# EAGLE design M1103A (EAGLE 6.6.0)
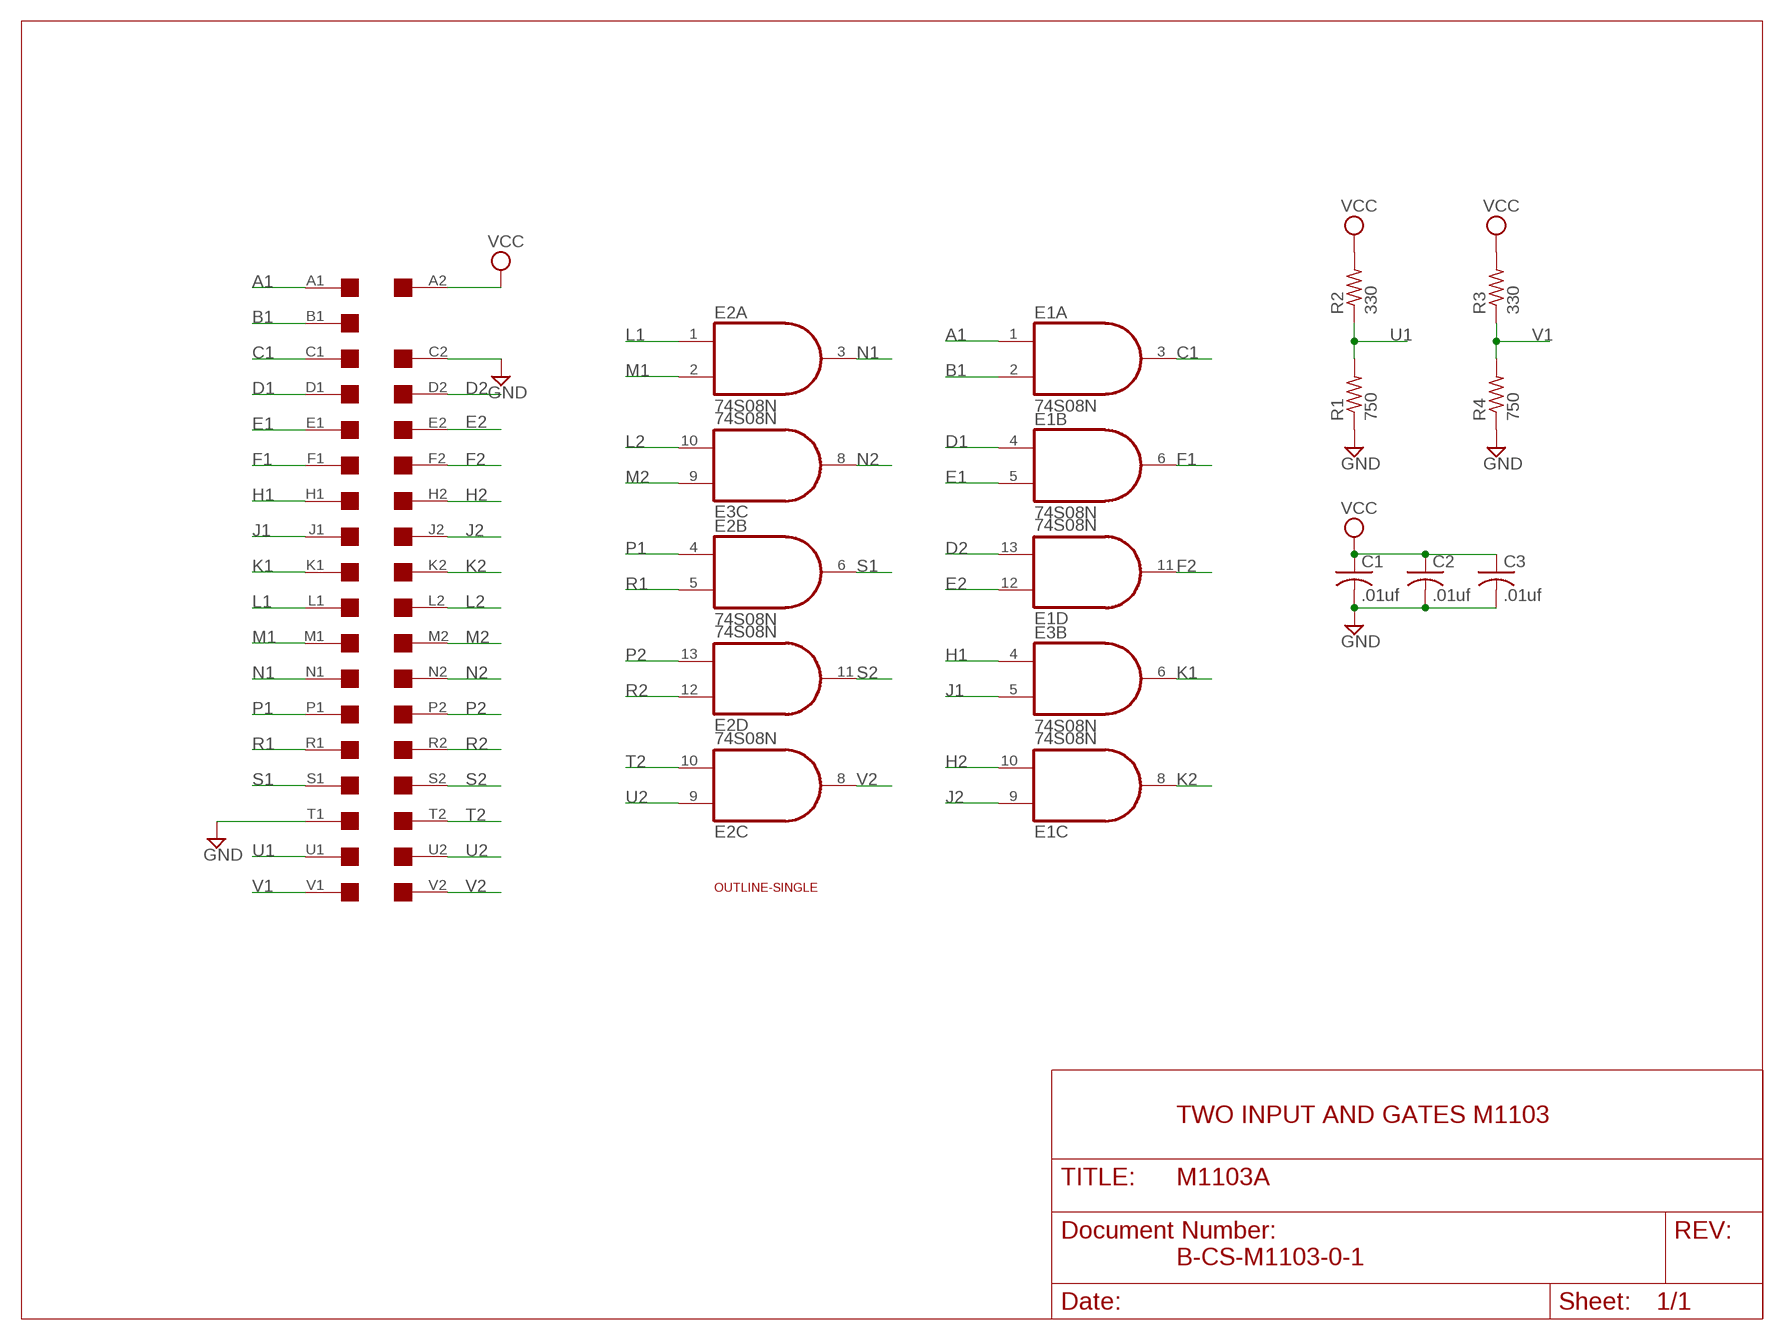
[diagram p0: schematic, sheet 1]

## Parts
C1  .01uf  C-US050-025X075  [C050-025X075]
C2  .01uf  C-US050-025X075  [C050-025X075]
C3  .01uf  C-US050-025X075  [C050-025X075]
E1  74S08N  [DIL14]
E2  74S08N  [DIL14]
E3  74S08N  [DIL14]
R1  750  R-US_0207/10  [0207/10]
R2  330  R-US_0207/10  [0207/10]
R3  330  R-US_0207/10  [0207/10]
R4  750  R-US_0207/10  [0207/10]
U$1  SINGLE  [EDGE-CON2]
U$2  OUTLINE-SINGLE  [SINGLE]

## Nets
A1: E1.1(A:I0) U$1.A1
B1: E1.2(A:I1) U$1.B1
C1: E1.3(A:O) U$1.C1
D1: E1.4(B:I0) U$1.D1
D2: E1.13(D:I1) U$1.D2
E1: E1.5(B:I1) U$1.E1
E2: E1.12(D:I0) U$1.E2
F1: E1.6(B:O) U$1.F1
F2: E1.11(D:O) U$1.F2
GND [Supply]: C1.2 C2.2 C3.2 R1.1 R4.1 U$1.C2 U$1.T1
H1: E3.4(B:I0) U$1.H1
H2: E1.10(C:I1) U$1.H2
J1: E3.5(B:I1) U$1.J1
J2: E1.9(C:I0) U$1.J2
K1: E3.6(B:O) U$1.K1
K2: E1.8(C:O) U$1.K2
L1: E2.1(A:I0) U$1.L1
L2: E3.10(C:I1) U$1.L2
M1: E2.2(A:I1) U$1.M1
M2: E3.9(C:I0) U$1.M2
N1: E2.3(A:O) U$1.N1
N2: E3.8(C:O) U$1.N2
P1: E2.4(B:I0) U$1.P1
P2: E2.13(D:I1) U$1.P2
R1: E2.5(B:I1) U$1.R1
R2: E2.12(D:I0) U$1.R2
S1: E2.6(B:O) U$1.S1
S2: E2.11(D:O) U$1.S2
T2: E2.10(C:I1) U$1.T2
U1: R1.2 R2.1 U$1.U1
U2: E2.9(C:I0) U$1.U2
V1: R3.1 R4.2 U$1.V1
V2: E2.8(C:O) U$1.V2
VCC [Supply]: C1.1 C2.1 C3.1 R2.2 R3.2 U$1.A2
Unconnected: E3.1(A:I0) E3.2(A:I1) E3.3(A:O) E3.11(D:O) E3.12(D:I0) E3.13(D:I1) U$1.B2

## Notes on the sheet
- TWO INPUT AND GATES M1103
- B-CS-M1103-0-1

## Power pins joined to a net without a drawn wire
GND: E1.7(P:GND) E2.7(P:GND) E3.7(P:GND)
VCC: E1.14(P:VCC) E2.14(P:VCC) E3.14(P:VCC)

## Library data of the parts
C1-C3 = rcl:C-US: CAPACITOR, American symbol
E1-E3 = 74xx-us:74*08: Quad 2-input AND gate
R1-R4 = rcl:R-US_: RESISTOR, American symbol
U$1 = dec-con:SINGLE: Single-Height DEC board
U$2 = dec-con:OUTLINE-*: Board outlines for DEC boards.

## Net classes
1 Supply: width 0.813 mm

## Board
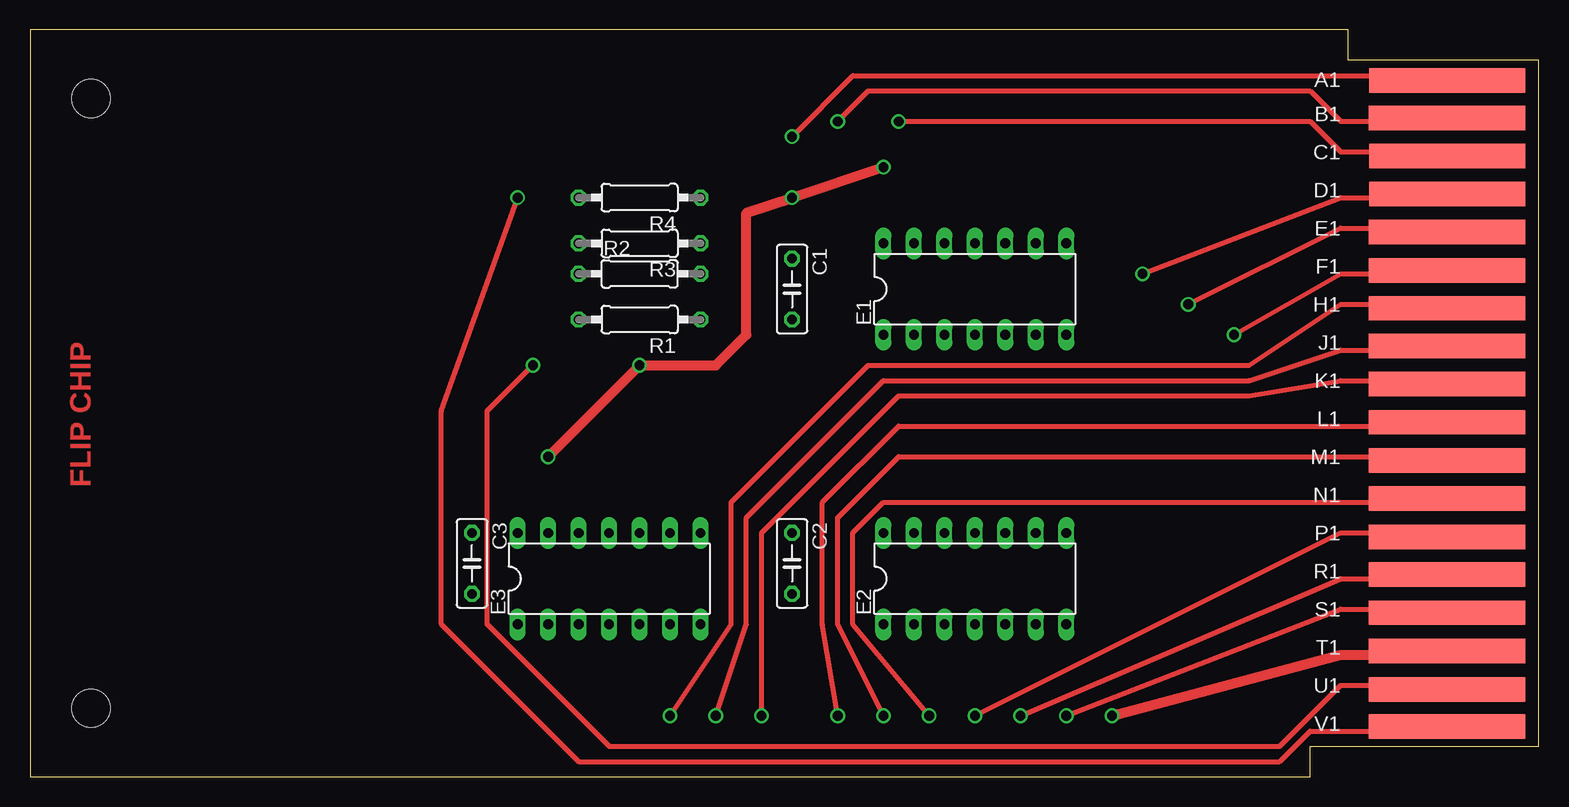
[diagram p1: board, top side]
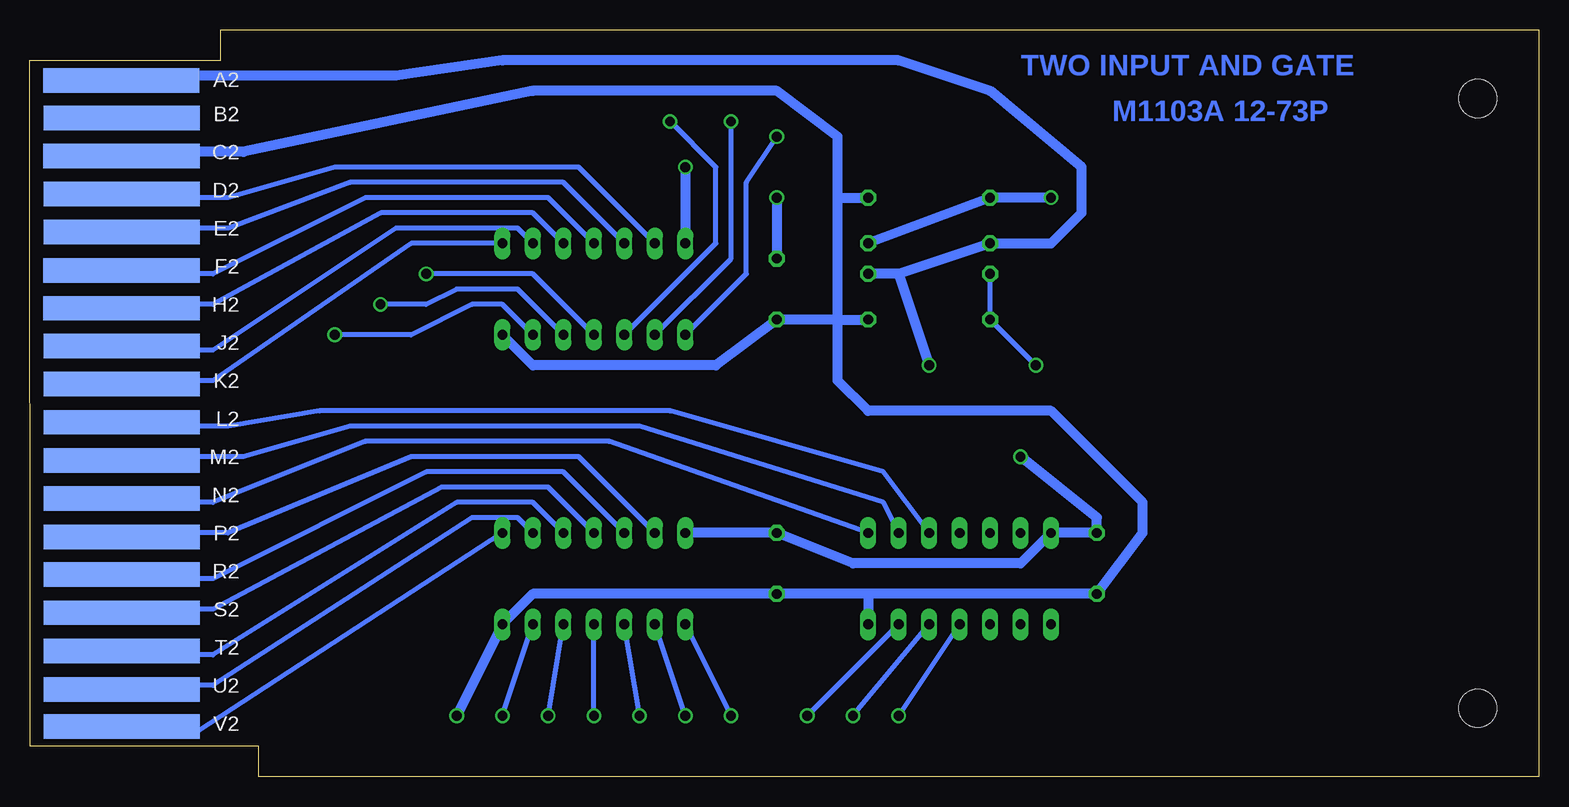
[diagram p2: board, bottom side, seen from below]

Size 125.73 x 62.23 mm. Coordinates in mm from the lower left corner, seen from the top.
Copper layers (1+16): Top 0.035mm / dielectric 1.5mm / Bottom 0.035mm
Design rules "16mils": minimum track width 16mil, minimum drill 32mil, track to track 15mil, track to pad 10mil, pad to pad 10mil, via to via 10mil, smd to smd 10mil, copper to edge 25mil, drill to drill 10mil, minimum pad ring 10mil, minimum via ring 8mil, stop-mask expansion 0mil, vias tented up to drill 0mil, thermal gap 10mil

### Footprints (pad centres in the part's own frame; a part is rotated, then mirrored left to right if it is on the bottom)
C050-025X075 = drill 0.813 octagon: 1 -2.54,0; 2 2.54,0
DIL14 = drill 0.813 long: 1 -7.62,-3.81; 2 -5.08,-3.81; 3 -2.54,-3.81; 4 0,-3.81; 5 2.54,-3.81; 6 5.08,-3.81; 7 7.62,-3.81; 8 7.62,3.81; 9 5.08,3.81; 10 2.54,3.81; 11 0,3.81; 12 -2.54,3.81; 13 -5.08,3.81; 14 -7.62,3.81
0207/10 = drill 0.813 octagon: 1 -5.08,0; 2 5.08,0
EDGE-CON2 = smd 13.017 x 2.032: A1 7.633,4.207; B1 7.639,7.327; C1 7.636,10.489; D1 7.633,13.665; E1 7.642,16.84; F1 7.642,20.041; H1 7.642,23.19; J1 7.642,26.34; K1 7.642,29.515; L1 7.642,32.69; M1 7.642,35.89; N1 7.642,39.04; P1 7.642,42.24; R1 7.642,45.39; S1 7.642,48.565; T1 7.642,51.74; U1 7.642,54.966; V1 7.642,58.026 | smd 13.017 x 2.032 bottom: A2 7.614,4.207; B2 7.642,7.328; C2 7.617,10.49; D2 7.642,13.665; E2 7.642,16.84; F2 7.617,20.041; H2 7.617,23.19; J2 7.642,26.34; K2 7.642,29.515; L2 7.642,32.69; M2 7.642,35.89; N2 7.642,39.04; P2 7.642,42.24; R2 7.642,45.39; S2 7.642,48.565; T2 7.642,51.74; U2 7.642,54.966; V2 7.642,58.026
SINGLE = hole 3.175: 120.65,56.515; 120.65,5.715

### Placement (x,y rotation side)
C1  63.5,40.64 270 top
C2  63.5,17.78 270 top
C3  36.83,17.78 270 top
E1  78.74,40.64 0 top
E2  78.74,16.51 0 top
E3  48.26,16.51 0 top
R1  50.8,38.1 180 top
R2  50.8,41.91 0 top
R3  50.8,44.45 180 top
R4  50.8,48.26 180 top
U$1  125.73,62.23 180 top
U$2  125.73,62.23 180 top

### Tracks (layer width: path | path; a pad name or v marks a point on that pad's centre or on a via)
A1  (via drill 0.81)
  Top 0.406: U$1.A1 116.84,58.42 68.58,58.42 v63.5,53.34
  Bottom 0.406: E1.1 66.04,41.91 66.04,49.53 v63.5,53.34
B1  (via drill 0.81)
  Top 0.406: U$1.B1 116.84,54.61 109.22,54.61 106.68,57.15 69.85,57.15 v67.31,54.61
  Bottom 0.406: E1.2 67.31,43.18 v67.31,54.61
C1  (via drill 0.81)
  Top 0.406: U$1.C1 115.57,52.07 109.22,52.07 106.68,54.61 v72.39,54.61
  Bottom 0.406: E1.3 68.58,44.45 68.58,50.8 v72.39,54.61
D1  (via drill 0.81)
  Top 0.406: U$1.D1 116.84,48.26 109.22,48.26 v92.71,41.91
  Bottom 0.406: v92.71,41.91 83.82,41.91 E1.4
D2
  Bottom 0.406: U$1.D2 116.84,48.26 109.22,48.26 100.33,50.8 80.01,50.8 E1.13
E1  (via drill 0.81)
  Top 0.406: U$1.E1 116.84,45.72 109.22,45.72 v96.52,39.37
  Bottom 0.406: v96.52,39.37 92.71,39.37 90.17,40.64 85.09,40.64 E1.5
E2
  Bottom 0.406: U$1.E2 116.84,45.72 109.22,45.72 99.06,49.53 81.28,49.53 E1.12
F1  (via drill 0.81)
  Top 0.406: U$1.F1 115.57,41.91 109.22,41.91 v100.33,36.83
  Bottom 0.406: v100.33,36.83 93.98,36.83 88.9,39.37 86.36,39.37 E1.6
F2
  Bottom 0.406: U$1.F2 116.84,41.91 110.49,41.91 97.79,48.26 82.55,48.26 E1.11
GND  (via drill 0.81)
  Top 0.813: U$1.T1 116.84,10.16 109.22,10.16 v90.17,5.08
  Bottom 0.813: v90.17,5.08 E2.7 83.82,15.24 C2.2 55.88,15.24 | 55.88,15.24 C3.2 33.02,20.32 33.02,22.86 40.64,30.48 55.88,30.48 58.42,33.02 58.42,38.1 | 55.88,15.24 E3.7 | 58.42,48.26 R4.1 | 58.42,38.1 58.42,48.26 | 58.42,38.1 R1.1 | 58.42,38.1 C1.2 68.58,34.29 83.82,34.29 E1.7 | U$1.C2 116.84,52.07 107.95,52.07 83.82,57.15 63.5,57.15 58.42,53.34 58.42,48.26
H1  (via drill 0.81)
  Top 0.406: v53.34,5.08 58.42,12.7 58.42,22.86 69.85,34.29 101.6,34.29 109.22,39.37 116.84,39.37 U$1.H1
  Bottom 0.406: v53.34,5.08 E3.4
H2
  Bottom 0.406: U$1.H2 116.84,39.37 110.49,39.37 96.52,46.99 83.82,46.99 E1.10
J1  (via drill 0.81)
  Top 0.406: v57.15,5.08 59.69,12.7 59.69,21.59 71.12,33.02 101.6,33.02 109.22,35.56 116.84,35.56 U$1.J1
  Bottom 0.406: v57.15,5.08 E3.5
J2
  Bottom 0.406: U$1.J2 116.84,35.56 110.49,35.56 95.25,45.72 85.09,45.72 E1.9
K1  (via drill 0.81)
  Top 0.406: v60.96,5.08 60.96,20.32 72.39,31.75 101.6,31.75 109.22,33.02 116.84,33.02 U$1.K1
  Bottom 0.406: E3.6 v60.96,5.08
K2
  Bottom 0.406: U$1.K2 116.84,33.02 110.49,33.02 93.98,44.45 E1.8
L1  (via drill 0.81)
  Top 0.406: v67.31,5.08 66.04,12.7 66.04,22.86 72.39,29.21 116.84,29.21 U$1.L1
  Bottom 0.406: v67.31,5.08 E2.1
L2
  Bottom 0.406: U$1.L2 115.57,29.21 109.22,29.21 101.6,30.48 72.39,30.48 54.61,25.4 E3.10
M1  (via drill 0.81)
  Top 0.406: v71.12,5.08 67.31,12.7 67.31,21.59 72.39,26.67 116.84,26.67 U$1.M1
  Bottom 0.406: v71.12,5.08 E2.2
M2
  Bottom 0.406: U$1.M2 116.84,26.67 107.95,26.67 99.06,29.21 74.93,29.21 54.61,22.86 E3.9
N1  (via drill 0.81)
  Top 0.406: v74.93,5.08 68.58,12.7 68.58,20.32 71.12,22.86 116.84,22.86 U$1.N1
  Bottom 0.406: v74.93,5.08 E2.3
N2
  Bottom 0.406: U$1.N2 116.84,22.86 110.49,22.86 97.79,27.94 77.47,27.94 E3.8
P1  (via drill 0.81)
  Top 0.406: U$1.P1 116.84,20.32 109.22,20.32 v78.74,5.08
  Bottom 0.406: v78.74,5.08 E2.4
P2
  Bottom 0.406: U$1.P2 116.84,20.32 109.22,20.32 93.98,26.67 80.01,26.67 E2.13
R1  (via drill 0.81)
  Top 0.406: U$1.R1 115.57,16.51 109.22,16.51 v82.55,5.08
  Bottom 0.406: v82.55,5.08 E2.5
R2
  Bottom 0.406: U$1.R2 116.84,16.51 110.49,16.51 92.71,25.4 81.28,25.4 E2.12
S1  (via drill 0.81)
  Top 0.406: U$1.S1 116.84,13.97 109.22,13.97 v86.36,5.08
  Bottom 0.406: v86.36,5.08 E2.6
S2
  Bottom 0.406: U$1.S2 116.84,13.97 110.49,13.97 91.44,24.13 82.55,24.13 E2.11
T2
  Bottom 0.406: U$1.T2 116.84,10.16 110.49,10.16 90.17,22.86 83.82,22.86 E2.10
U1  (via drill 0.81)
  Top 0.406: U$1.U1 116.84,7.62 109.22,7.62 104.14,2.54 48.26,2.54 38.1,12.7 38.1,30.48 v41.91,34.29
  Bottom 0.406: R2.1 R1.2 v41.91,34.29
U2
  Bottom 0.406: U$1.U2 116.84,7.62 110.49,7.62 88.9,21.59 85.09,21.59 E2.9
V1  (via drill 0.81)
  Top 0.406: U$1.V1 116.84,3.81 106.68,3.81 104.14,1.27 45.72,1.27 34.29,12.7 34.29,30.48 v40.64,48.26
  Bottom 0.813: v40.64,48.26 R4.2 R3.1
V2
  Bottom 0.406: U$1.V2 116.84,3.81 111.76,3.81 E2.8
VCC  (via drill 0.81)
  Top 0.813: v71.12,50.8 v63.5,48.26 59.69,46.99 59.69,36.83 57.15,34.29 v50.8,34.29 v43.18,26.67
  Bottom 0.813: E2.14 C2.1 57.15,17.78 43.18,17.78 E3.14 C3.1 36.83,21.59 v43.18,26.67 | v63.5,48.26 C1.1 | v71.12,50.8 E1.14 | 53.34,41.91 R2.2 | 53.34,41.91 R3.2 40.64,44.45 38.1,46.99 38.1,50.8 45.72,57.15 53.34,59.69 86.36,59.69 95.25,58.42 116.84,58.42 U$1.A2 | v50.8,34.29 53.34,41.91

### Text on the board
Top: FLIP CHIP
Bottom: TWO INPUT AND GATE | M1103A 12-73P